# Altium project led_frontend.PrjPcb
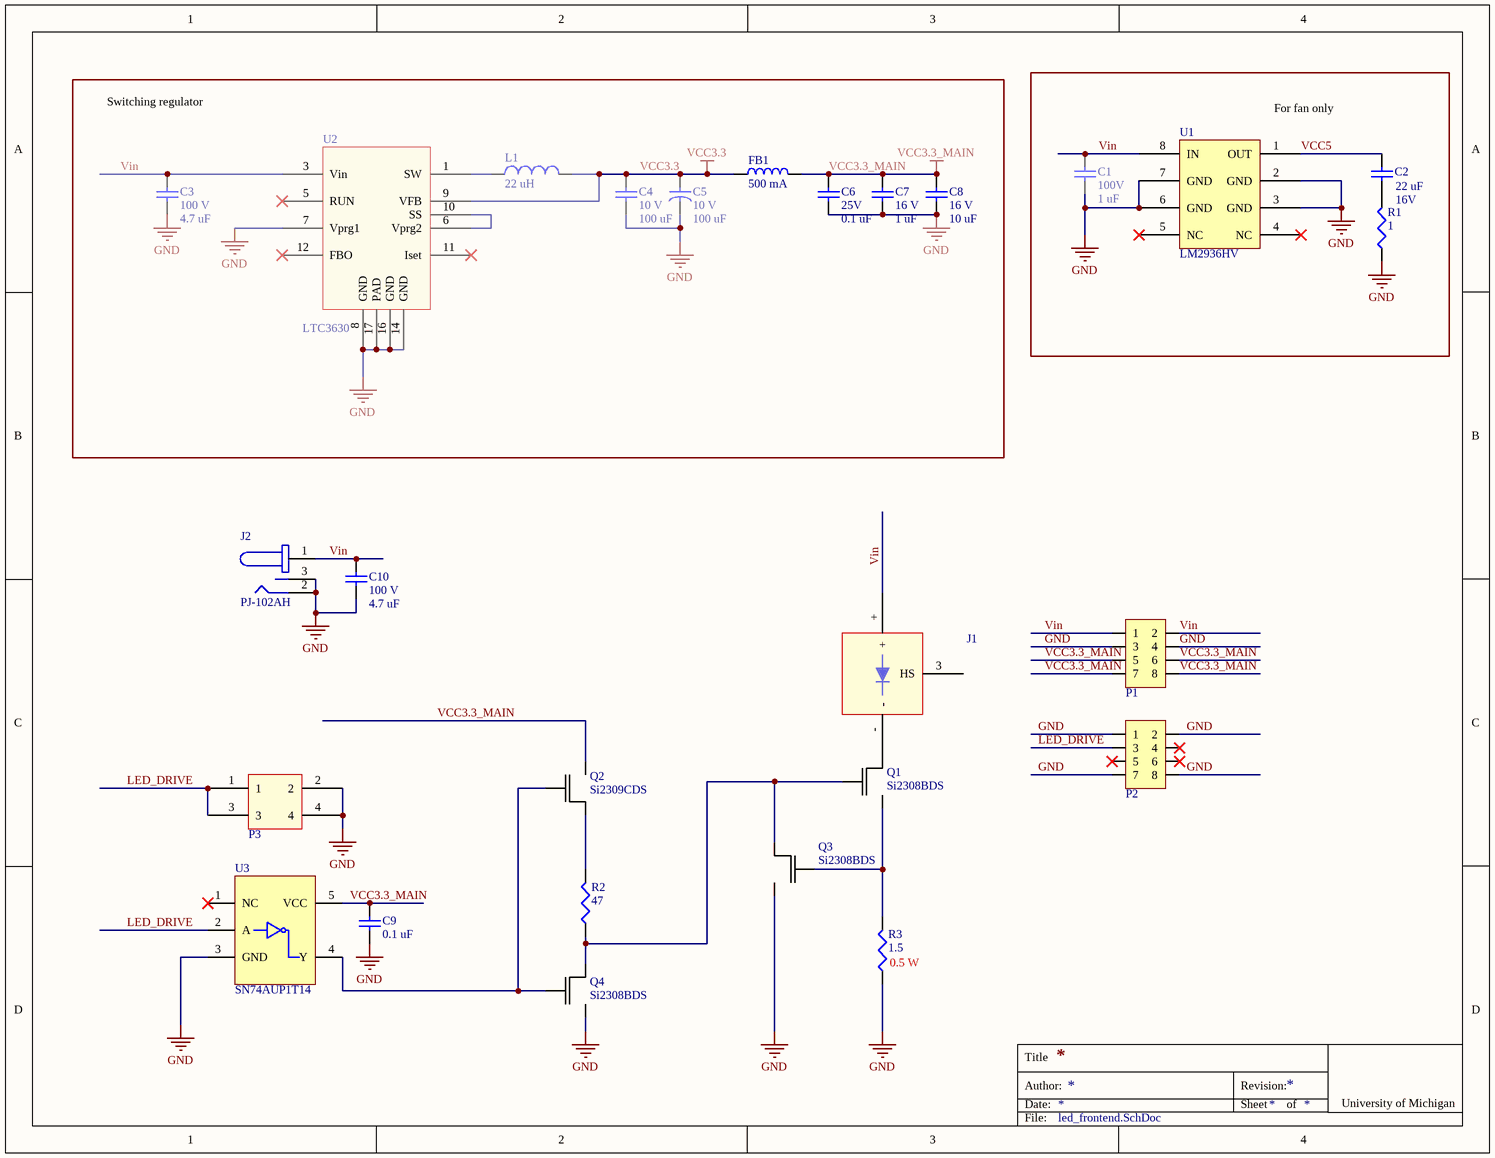
[diagram p0: led_frontend.SchDoc]
1 sheet, 27 parts. Net scope: global (net labels, ports and power ports of the same name join across sheets).
Board file: led_frontend.PcbDoc

## Sheet led_frontend.SchDoc
size Letter

### Parts
C1  value 1 uF  voltage rated: 100V  [0805]  (hidden comment: Ceramic capacitor)
C2  value 22 uF  voltage rated: 16V  [1206]  (hidden comment: Ceramic capacitor)
C3  value 4.7 uF  voltage rated: 100 V  [2220]  (hidden comment: Ceramic capacitor)
C4  value 100 uF  voltage rated: 10 V  [1210]  (hidden comment: Ceramic capacitor)
C5  value 100 uF  voltage rated: 10 V  [2917]  (hidden comment: Ceramic capacitor)
C6  value 0.1 uF  voltage rated: 25V  [0603]  (hidden comment: Ceramic capacitor)
C7  value 1 uF  voltage rated: 16 V  [0603]  (hidden comment: Ceramic capacitor)
C8  value 10 uF  voltage rated: 16 V  [0603]  (hidden comment: Ceramic capacitor)
C9  value 0.1 uF  [0603]  (hidden comment: Ceramic capacitor)
C10  value 4.7 uF  voltage rated: 100 V  [2220]  (hidden comment: Ceramic capacitor)
FB1  current rating: 500 mA  [0603]  (hidden comment: Ferrite Bead)
J1  1807200002  [molex]  (value not drawn)
J2  PJ-102AH  [PJ-102AH]
L1  value 22 uH  [SLF10145]  (hidden comment: L_22uH_SLF10145)
P1  HW-04-20-F-D-900-SM  [HW-04-20-F-D-900-SM]  (value not drawn)
P2  HW-04-20-F-D-900-SM  [HW-04-20-F-D-900-SM]  (value not drawn)
P3  2 x 2 header SMD  [2x2 header SMD]  (value not drawn)
Q1  Si2308BDS  [SOT23-3]
Q2  Si2309CDS  [SOT23-3]
Q3  Si2308BDS  [SOT23-3]
Q4  Si2308BDS  [SOT23-3]
R1  value 1  [0603]  (hidden comment: Chip resistor)
R2  value 47  [0603]  (hidden comment: Chip resistor)
R3  value 1.5  [1210]  (hidden comment: Chip resistor)
U1  LM2936HV  [SOIC-8]
U2  LTC3630  [MSE16(12)]
U3  SN74AUP1T14  [SC-70-5 (DCK)]

### Nets
GND: C1.2 C3.2 C4.2 C5.2 C6.2 C7.2 C8.2 C9.2 C10.2 J2.2 J2.3 P1.3 P1.4 P2.1 P2.2 P2.7 P2.8 P3.2 P3.4 Q3.2(S) Q4.2(S) R1.2 R3.2 U1.2(GND) U1.3(GND) U1.6(GND) U1.7(GND) U2.7(Vprg1) U2.8(GND) U2.14(GND) U2.16(GND) U2.17(PAD) U3.3(GND)
VCC3.3: C4.1 C5.1 FB1.2 L1.1 U2.9(VFB)
VCC3.3_MAIN: C6.1 C7.1 C8.1 C9.1 FB1.1 P1.5 P1.6 P1.7 P1.8 Q2.2(S) U3.5(VCC)
LED_DRIVE: P2.3 P3.1 P3.3 U3.2(A)
VCC5: C2.1 U1.1(OUT)
Vin: C1.1 C3.1 C10.1 J1.+ J2.1 P1.1 P1.2 U1.8(IN) U2.3(Vin)
NetC2_2: C2.2 R1.1
NetJ1_-: J1.- Q1.3(D)
NetL1_2: L1.2 U2.1(SW)
NetQ1_1: Q1.1(G) Q3.3(D) Q4.3(D) R2.2
NetQ1_2: Q1.2(S) Q3.1(G) R3.1
NetQ2_1: Q2.1(G) Q4.1(G) U3.4(Y)
NetQ2_3: Q2.3(D) R2.1
NetU2_6: U2.6(Vprg2) U2.10(SS)

Not connected (* = marked no-connect by the designer): J1 3(HS); P2 4* 5* 6*; U1 4(NC)* 5(NC)*; U2 5(RUN)* 11(Iset)* 12(FBO)*; U3 1(NC)*

### Notes on the sheet
- Switching regulator
- (near U1) For fan only
- (near R3) 0.5 W
- Title
- Date:
- Author:
- Revision:
- Sheet
- of
- University of Michigan
- File:

### Library data of the parts
C1 = C_1u_100V_0805_ceramic: Ceramic capacitor, 1 uF, 100 V, 0805 package; Manufacture: TDK; tolerance: 10%; Temperature Coefficient: X7S; package: 0805; Supplier 1: Digi-Key; Supplier Part Number 1: 445-5205-1-ND
C2 = C_22u_16V_1206_ceramic: Ceramic capacitor, 22 uF, 1206 package; Manufacture: Samsung; tolerance: 20%; package: 1206; Supplier 1: Digi-Key; Supplier Part Number 1: 1276-2728-1-ND
C3 C10 = C_4.7u_2220_ceramic: Ceramic capacitor, 4.7u, 2220 package; Manufacture: TDK; tolerance: 20%; Temp rating: X7R; package: 2220; Supplier 1: Digi-Key; Supplier Part Number 1: 445-1450-1-ND
C4 = C_100u_1210_ceramic: Ceramic capacitor, 100u, 1210 package; Manufacture: Samsung; tolerance: 20%; package: 2917; Supplier 1: Digi-Key; Supplier Part Number 1: 1276-3364-1-ND
C5 = C_100u_2917_tantalum: Tantalum capacitor, 100u, 2917 package; Manufacture: Kemet; tolerance: 10%; package: 2917; Supplier 1: Digi-Key; Supplier Part Number 1: 399-3769-1-ND
C6 = C_0.1u_25V_0603_ceramic: Ceramic capacitor, 0.1 uF, 0603 package; Manufacture: TDK; tolerance: 10%; package: 0603; Supplier 1: Digi-Key; Supplier Part Number 1: 445-1316-1-ND
C7 = C_1u_16V_0603_ceramic: Ceramic capacitor, 1 uF, 16 V, 0603 package; Manufacture: TDK; tolerance: 10%; package: 0603; Supplier 1: Digi-Key; Supplier Part Number 1: 445-1604-1-ND
C8 = C_10u_16V_0603_ceramic: Ceramic capacitor, 10 uF, 16 V, 0603 package; Manufacture: TDK; tolerance: 20%; Temperature Coefficient: X5R; package: 0603; Supplier 1: Digi-Key; Supplier Part Number 1: 445-9065-6-ND
C9 = C_0.1u_25V_0603_ceramic: Ceramic capacitor, 0.1 uF, 0603 package; Manufacture: TDK; voltage rated: 25V; tolerance: 10%; package: 0603; Supplier 1: Digi-Key; Supplier Part Number 1: 445-1316-1-ND
FB1 = FB_500mA_0603: Ferrite Bead, 500 mA, 0603 package; impedance@Freq: 120@100 MHz; DC resistance: 180 m; package: 0603; Supplier 1: Digi-Key; Supplier Part Number 1: 490-1011-1-ND
J1 = Molex LED holder: LED Array Holders  for CREE* XLamp†   Arrays; Supplier 1: Digi-Key; Supplier Part Number 1: WM10352-ND
J2 = PJ-102AH: CONN PWR JACK 2.1X5.5MM HIGH CUR; Supplier 1: Digi-Key; Supplier Part Number 1: CP-102AH-ND
L1 = L_22uH_SLF10145: Inductor, 22 uH, TDK SLF10145; Saturation current: 2.1 A; Supplier 1: Digi-Key; Supplier Part Number 1: 445-1981-1-ND
P1 P2 = HW-04-20-F-D-900-SM: Samtec 2x4 100 mil connector
P3 = 2 x 2 header SMD: 2x2 100 mil header SMD; Supplier 1: Digi-Key; Supplier Part Number 1: 609-4463-6-ND
Q1 Q3 Q4 = Si2308BDS: N-Channel 60-V (D-S) MOSFET; Supplier 1: Digi-Key; Supplier Part Number 1: SI2308BDS-T1-E3CT-ND
Q2 = Si2309CDS: P-Channel 60-V (D-S) MOSFET; Supplier 1: Digi-Key; Supplier Part Number 1: SI2309CDS-T1-E3CT-ND
R1 = R_1_0603: Chip resistor, 1,  0603 package; tolerance: 1%; power: 1/10 W; Temperature Coefficient: 100 ppm; package: 0603; Supplier 1: Digi-Key; Supplier Part Number 1: 541-1.00HHCT-ND
R2 = R_47_0603: Chip resistor, 47, 0603 package; tolerance: 1%; power: 1/10 W; package: 0603; Supplier 1: Digi-Key; Supplier Part Number 1: 541-47.0HCT-ND
R3 = R_1.5_1210: Chip resistor, 1.5, 1210 package; power: 0.5 W; package: 1210; Supplier 1: Digi-Key; Supplier Part Number 1: P1.5VTR-ND
U1 = LM2936HV: Ultra-Low Quiescent Current LDO Voltage Regulator; Supplier 1: Digi-Key; Supplier Part Number 1: LM2936HVMAX-5.0/NOPBCT-ND
U2 = LTC3630: High Efficiency, 65V 500mA synchronous Step-Down Converter; Supplier 1: Digi-Key; Supplier Part Number 1: LTC3630EMSE#PBF-ND
U3 = SN74AUP1T14: LOW POWER, 1.8/2.5/3.3-V INPUT, 3.3-V CMOS OUTPUT, SINGLE  SCHMITT-TRIGGER INVERTER GATE; Supplier 1: Digi-Key; Supplier Part Number 1: 296-27392-1-ND